# EasyEDA Pro project 2024-4T-MNT-2.eprj

# Schematic 15B_SCH
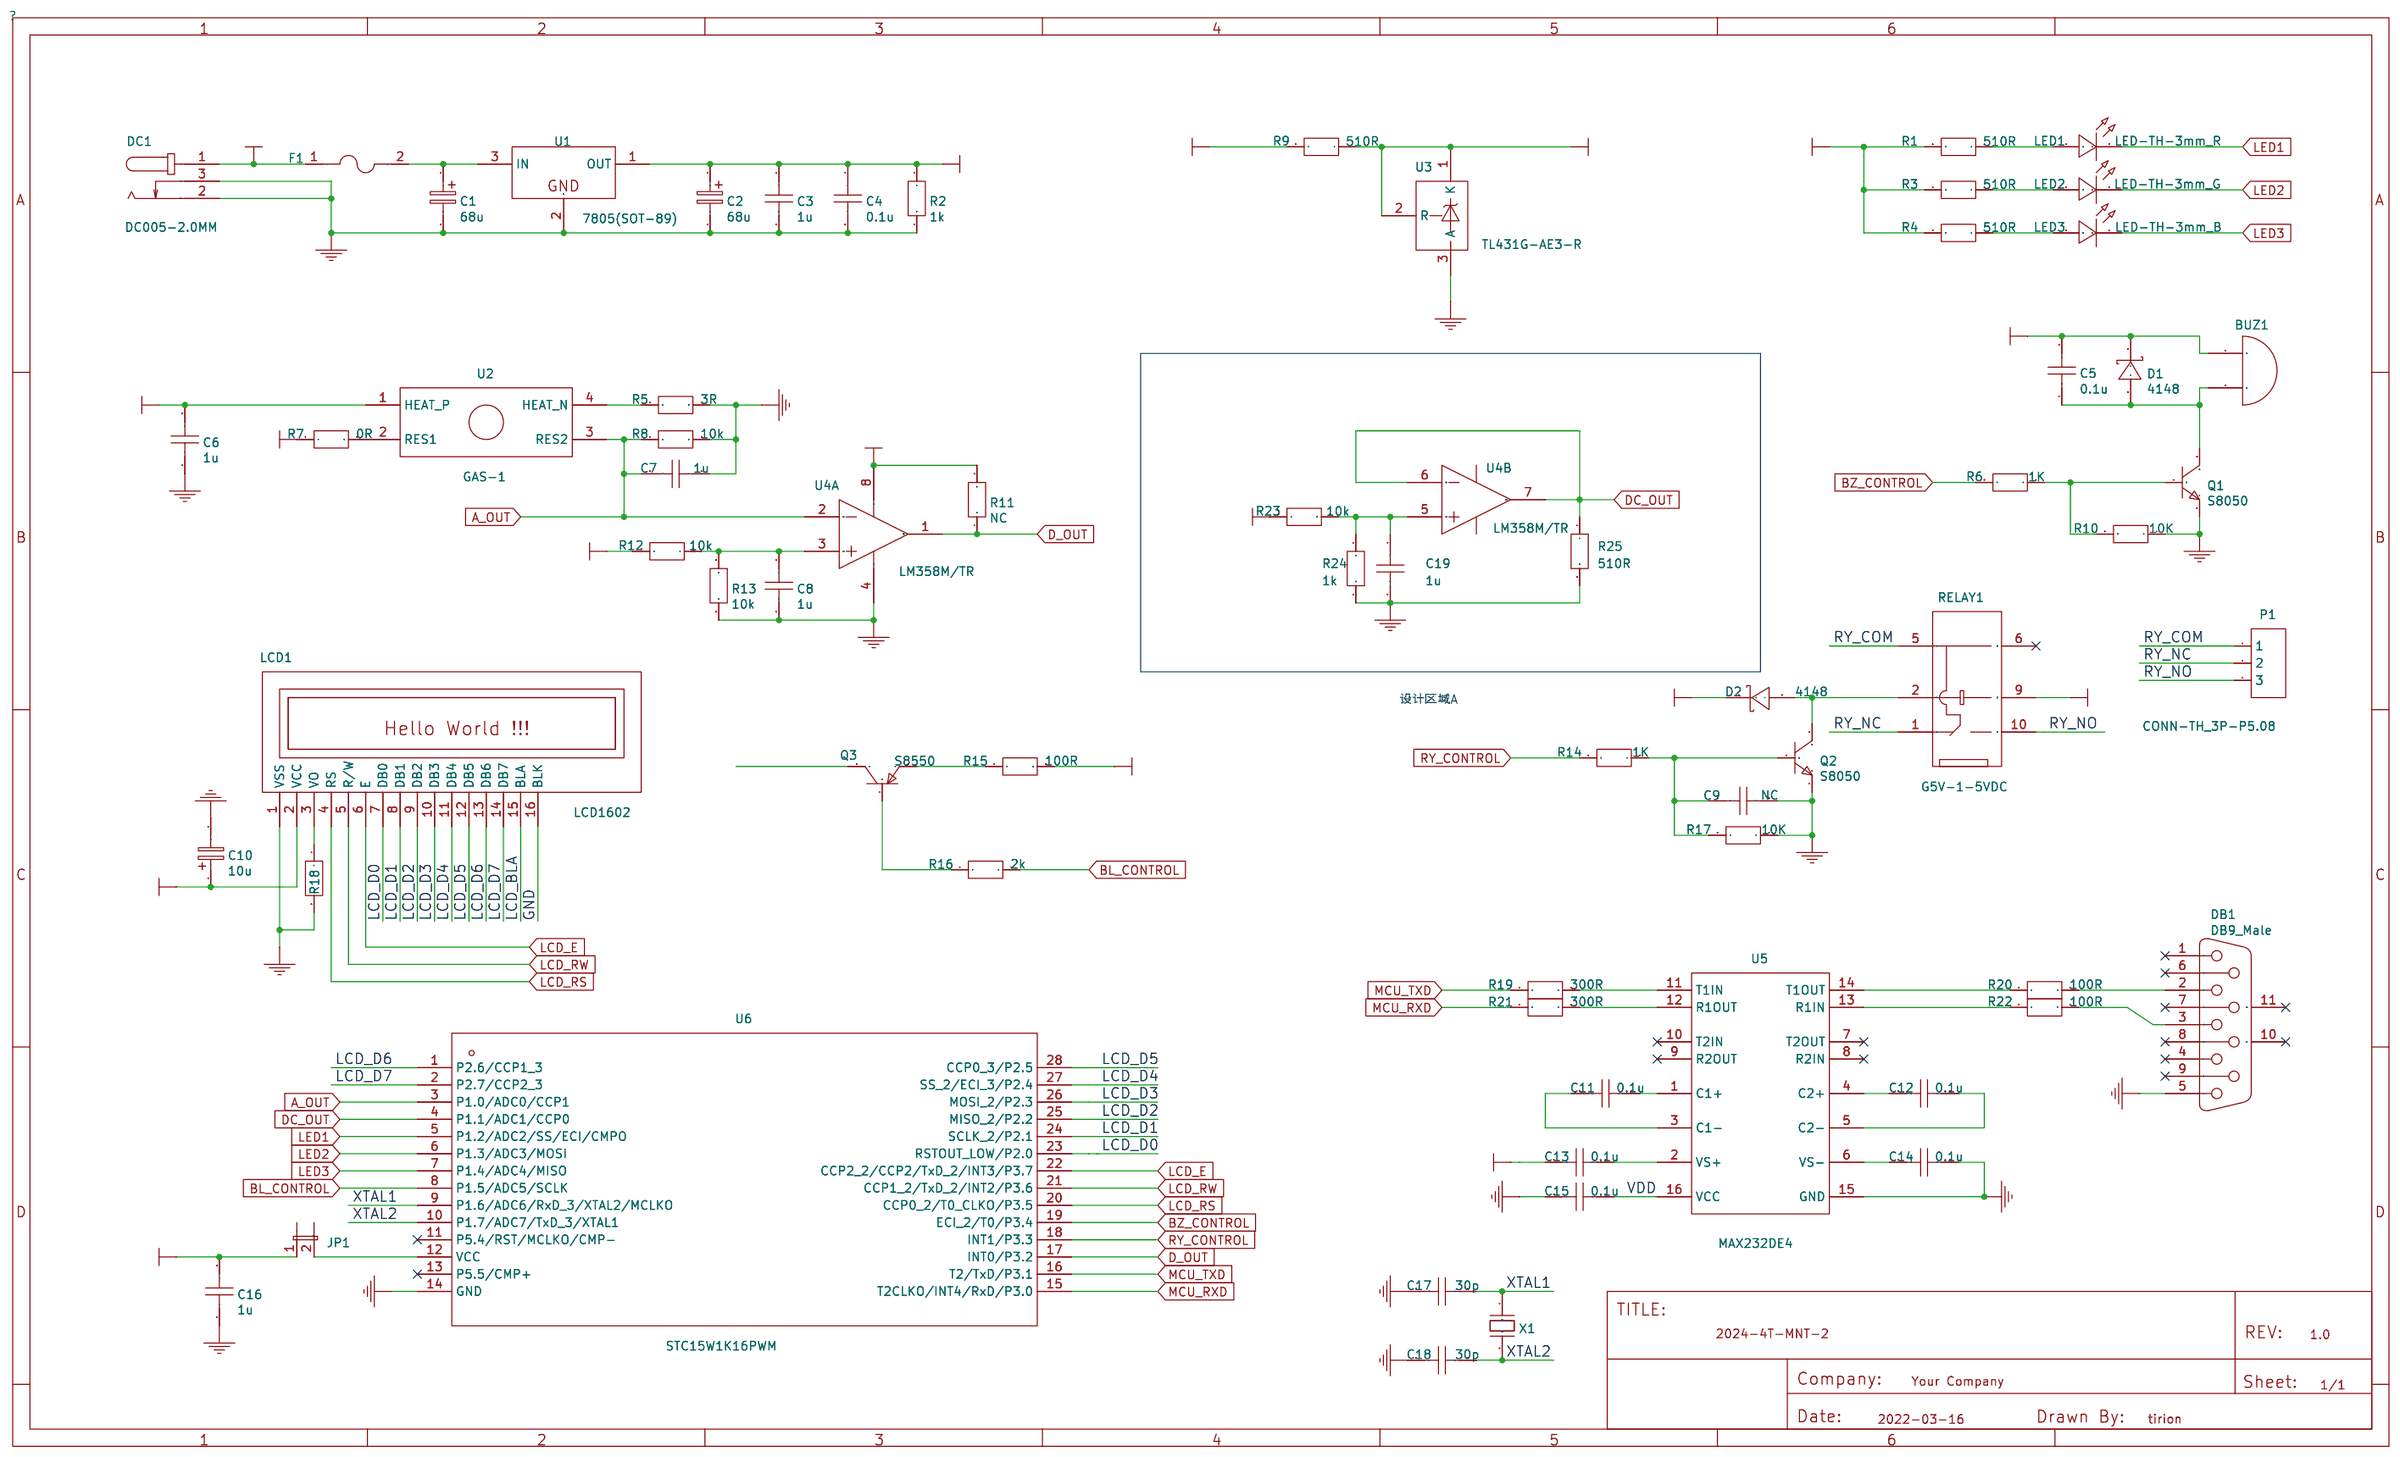
[diagram p0: schematic sheet]

## Parts
BUZ1  BUZ1  [BUZZ]
C1  68u  [CAP-D6.3×H5.5]
C2  68u  [CAP-D6.3×H5.5]
C3  1u  [C0805]
C4  0.1u  [C0805]
C5  0.1u  [C0805]
C6  1u  [C0805]
C7  1u  [C0805]
C8  1u  [C0805]
C9  NC  [C0805]
C10  10u  [CAP-D5.0×H5.5]
C11  0.1u  [C0805]
C12  0.1u  [C0805]
C13  0.1u  [C0805]
C14  0.1u  [C0805]
C15  0.1u  [C0805]
C16  1u  [C0805]
C17  30p  [C0805]
C18  30p  [C0805]
C19  1u  [C0805]
D1  4148  [SMA_L4.4-W2.8-LS5.4-RD]
D2  4148  [SMA_L4.4-W2.8-LS5.4-RD]
DB1  DB9_Male  [DSUB-TH_DMR-9P]
DC1  DC005-2.0MM  [DC-IN-TH_DC005]
F1  FUSE_F1812_FUSE  [F1812]
JP1  JUMPER2  [JUMPER2]
LCD1  LCD1602  [LCD1602]
LED1  LED-TH-3mm_R  [LED-TH_BD3.0_RED]
LED2  LED-TH-3mm_G  [LED-TH_BD3.0_GREEN]
LED3  LED-TH-3mm_B  [LED-TH_BD3.0_BLUE]
P1  CONN-TH_3P-P5.08  [CONN-TH_3P-P5.08]
Q1  S8050  [SOT-23-3_L2.9-W1.3-P1.90-LS2.4-BR]
Q2  S8050  [SOT-23-3_L2.9-W1.3-P1.90-LS2.4-BR]
Q3  S8550  [SOT-23-3_L2.9-W1.3-P1.90-LS2.4-BR]
R1  510R  [R0805]
R2  1k  [R0805]
R3  510R  [R0805]
R4  510R  [R0805]
R5  3R  [R0805]
R6  1K  [R0805]
R7  0R  [R0805]
R8  10k  [R0805]
R9  510R  [R0805]
R10  10K  [R0805]
R11  NC  [R0805]
R12  10k  [R0805]
R13  10k  [R0805]
R14  1K  [R0805]
R15  100R  [R0805]
R16  2k  [R0805]
R17  10K  [R0805]
R18  10k  [R0805]
R19  300R  [R0805]
R20  100R  [R0805]
R21  300R  [R0805]
R22  100R  [R0805]
R23  10k  [R0805]
R24  1k  [R0805]
R25  510R  [R0805]
RELAY1  G5V-1-5VDC  [RELAY-TH_G5V-1]
U1  7805(SOT-89)  [SOT-89-3_L4.5-W2.5-P1.50-LS4.2-BR]
U2  GAS-1  [GAS-1]
U3  TL431G-AE3-R  [SOT-23-3_L2.9-W1.3-P1.90-LS2.4-TR]
U4  LM358M/TR  [SOP-8_L4.9-W3.9-P1.27-LS6.0-BL]  (sections 1,2)
U5  MAX232DE4  [SOIC16N]
U6  STC15W1K16PWM  [SOP-28_L17.9-W7.5-P1.27-LS10.3-BL]
X1  12MHZ  [OSC-49U-1]

## Library data of the parts
BUZ1 = BUZ1
C1 C2 = 68u
C3 C6-C8 C16 C19 = 1u
C4 C5 C11-C15 = 0.1u
C9 R11 = NC
C10 = 10u
C17 C18 = 30p
D1 D2 = SS14: Supplier: LCSC; Manufacturer: MDD; Supplier Part: C2480; JLCPCB Part Class: Basic Part
DB1 = DB9_Male: Supplier Part: C185657; Supplier: LCSC; Manufacturer: Amphenol
DC1 = DC005-2.0MM: Supplier: LCSC; Manufacturer: SOFNG; Supplier Part: C111567
F1 = FUSE_F1812_FUSE: Supplier: LCSC; Supplier Part: C9900007509; JLCPCB Part Class: Extended Part
JP1 = JUMPER2: Jumper 2 Pin
LCD1 = LCM1602K-NSW-BBW: Manufacturer: LONTECH(厦门龙特); Supplier Part: C83275; Supplier: LCSC
LED1 = 204-10SDRD/S530-A3-L: Manufacturer: EVERLIGHT(台湾亿光); Supplier Part: C84774; Supplier: LCSC
LED2 = 204-10SYGD/S530-E3: Manufacturer: EVERLIGHT(台湾亿光); Supplier Part: C85161
LED3 = 204-10SUBC/S400-A4: Manufacturer: EVERLIGHT(台湾亿光); Supplier Part: C86881; Supplier: LCSC
P1 = CONN-TH_3P-P5.08: Supplier: LCSC
Q1 Q2 = S8050: Supplier: LCSC; Supplier Part: C916390; Manufacturer: JSMSEMI; JLCPCB Part Class: Extended Part
Q3 = S8550-H: Supplier: LCSC; Supplier Part: C699225; Manufacturer: Yangzhou Yangjie Elec Tech; JLCPCB Part Class: Extended Part
R1 R3 R4 R9 R25 = 510R
R2 R24 = 1k
R5 = 3R
R6 R14 = 1K
R7 = 0R
R8 R12 R13 R18 R23 = 10k
R10 R17 = 10K
R15 R20 R22 = 100R
R16 = 2k
R19 R21 = 300R
RELAY1 = G5V-1-5VDC: Supplier: LCSC; Manufacturer: OMRON; Supplier Part: C28695; JLCPCB Part Class: Extended Part
U1 = CJ78L05: Supplier: LCSC; Manufacturer: CJ; image: //image.lceda.cn/szlcsc/C2079.jpg; Supplier Part: C2079; Paste Type: expand
U2 = GAS-1
U3 = TL431G-AE3-R: Supplier: LCSC; Manufacturer: UTC; Supplier Part: C71130; JLCPCB Part Class: Extended Part
U4 = LM358M/TR: Supplier: LCSC; Supplier Part: C398078; Manufacturer: HGSEMI
U5 = MAX232DE4: Dual EIA-232 Driver  Receiver, 0 to 70 degC, 16-Pin SOIC (D), Green (RoHS  no SbBr)
U6 = STC15W1K16PWM: Supplier: LCSC; Manufacturer: STC; Supplier Part: C65670; JLCPCB Part Class: Extended Part
X1 = X49UD12MSD2SC: Supplier Part: undefined; Supplier: LCSC; Manufacturer: LCSC

## Nets
GND: C1.2 C2.2 C3.2 C4.2 C6.1 C7.1 C8.2 C9.2 C10.2 C14.2 C15.1 C16.1 C17.2 C18.2 C19.2 DB1.5 DC1.2 DC1.3 LCD1.1(VSS) LCD1.16(BLK) Q1.2(E) Q2.2(E) R2.2 R5.2 R8.2 R10.1 R13.2 R17.1 R18.2 R24.2 R25.2 U1.2(GND) U3.3(A) U4.4(GND) U5.15(GND) U6.14(GND)
VDD: BUZ1.1(A) C2.1 C3.1 C4.1 C5.2 C6.2 C10.1 C13.1 C15.2 C16.2 D1.1(K) D2.1(K) JP1.1 LCD1.2(VCC) R1.2 R2.1 R3.2 R4.2 R9.2 R11.2 R15.2 RELAY1.9 U1.1(OUT) U2.1(HEAT_P) U4.8(VCC) U5.16(VCC)
A_OUT: C7.2 R8.1 U2.3(RES2) U4.2(1IN-) U6.3(P1.0/ADC0/CCP1)
BL_CONTROL: R16.2 U6.8(P1.5/ADC5/SCLK)
BZ_CONTROL: R6.2 U6.19(ECI_2/T0/P3.4)
D_OUT: R11.1 U4.1(1OUT) U6.17(INT0/P3.2)
DC_IN: DC1.1 F1.1 R23.2
DC_OUT: R25.1 U4.6(2IN-) U4.7(2OUT) U6.4(P1.1/ADC1/CCP0)
LCD_BLA: LCD1.15(BLA)
LCD_D0: LCD1.7(DB0) U6.23(RSTOUT_LOW/P2.0)
LCD_D1: LCD1.8(DB1) U6.24(SCLK_2/P2.1)
LCD_D2: LCD1.9(DB2) U6.25(MISO_2/P2.2)
LCD_D3: LCD1.10(DB3) U6.26(MOSI_2/P2.3)
LCD_D4: LCD1.11(DB4) U6.27(SS_2/ECI_3/P2.4)
LCD_D5: LCD1.12(DB5) U6.28(CCP0_3/P2.5)
LCD_D6: LCD1.13(DB6) U6.1(P2.6/CCP1_3)
LCD_D7: LCD1.14(DB7) U6.2(P2.7/CCP2_3)
LCD_E: LCD1.6(E) U6.22(CCP2_2/CCP2/TxD_2/INT3/P3.7)
LCD_RS: LCD1.4(RS) U6.20(CCP0_2/T0_CLKO/P3.5)
LCD_RW: LCD1.5(R/W) U6.21(CCP1_2/TxD_2/INT2/P3.6)
LED1: LED1.2 U6.5(P1.2/ADC2/SS/ECI/CMPO)
LED2: LED2.2 U6.6(P1.3/ADC3/MOSI)
LED3: LED3.2 U6.7(P1.4/ADC4/MISO)
MCU_RXD: R21.1 U6.15(T2CLKO/INT4/RxD/P3.0)
MCU_TXD: R19.1 U6.16(T2/TxD/P3.1)
RY_COM: P1.1 RELAY1.5
RY_CONTROL: R14.2 U6.18(INT1/P3.3)
RY_NC: P1.2 RELAY1.1
RY_NO: P1.3 RELAY1.10
VREF: R7.1 R9.1 R12.2 U3.1(K) U3.2(R)
XTAL1: C17.1 U6.9(P1.6/ADC6/RxD_3/XTAL2/MCLKO) X1.1(OSC1)
XTAL2: C18.1 U6.10(P1.7/ADC7/TxD_3/XTAL1) X1.2(OSC2)
$1N38: R5.1 U2.4(HEAT_N)
$1N129: C8.1 R12.1 R13.1 U4.3(1IN+)
$1N261: C11.2 U5.1(C1+)
$1N262: C11.1 U5.3(C1-)
$1N307: C13.2 U5.2(VS+)
$1N323: C12.1 U5.4(C2+)
$1N324: C12.2 U5.5(C2-)
$1N325: C14.1 U5.6(VS-)
$1N349: R19.2 U5.11(T1IN)
$1N361: R21.2 U5.12(R1OUT)
$1N384: R20.1 U5.14(T1OUT)
$1N385: DB1.2 R20.2
$1N395: R22.1 U5.13(R1IN)
$1N396: DB1.3 R22.2
$1N410: JP1.2 U6.12(VCC)
$1N453: D2.2(A) Q2.3(C) RELAY1.2
$1N454: C9.1 Q2.1(B) R14.1 R17.2
$1N534: Q1.1(B) R6.1 R10.2
$1N571: BUZ1.2(B) C5.1 D1.2(A) Q1.3(C)
$1N627: LCD1.3(VO) R18.1
$1N796: LED1.1 R1.1
$1N816: LED3.1 R4.1
$1N817: LED2.1 R3.1
$1N913: C1.1 F1.2 U1.3(IN)
$1N1047: R7.2 U2.2(RES1)
$1N2159: Q3.2(E) R15.1
$1N2169: Q3.1(B) R16.1
$1N3986: C19.1 R23.1 R24.1 U4.5(2IN+)

Not connected (* = marked no-connect by the designer): DB1 1* 4* 6* 7* 8* 9* 10(MH1)* 11(MH2)*; Q3 3(C); RELAY1 6*; U5 7(T2OUT)* 8(R2IN)* 9(R2OUT)* 10(T2IN)*; U6 11(P5.4/RST/MCLKO/CMP-)* 13(P5.5/CMP+)*

## Notes on the sheet
- 设计区域A

# Board PCB
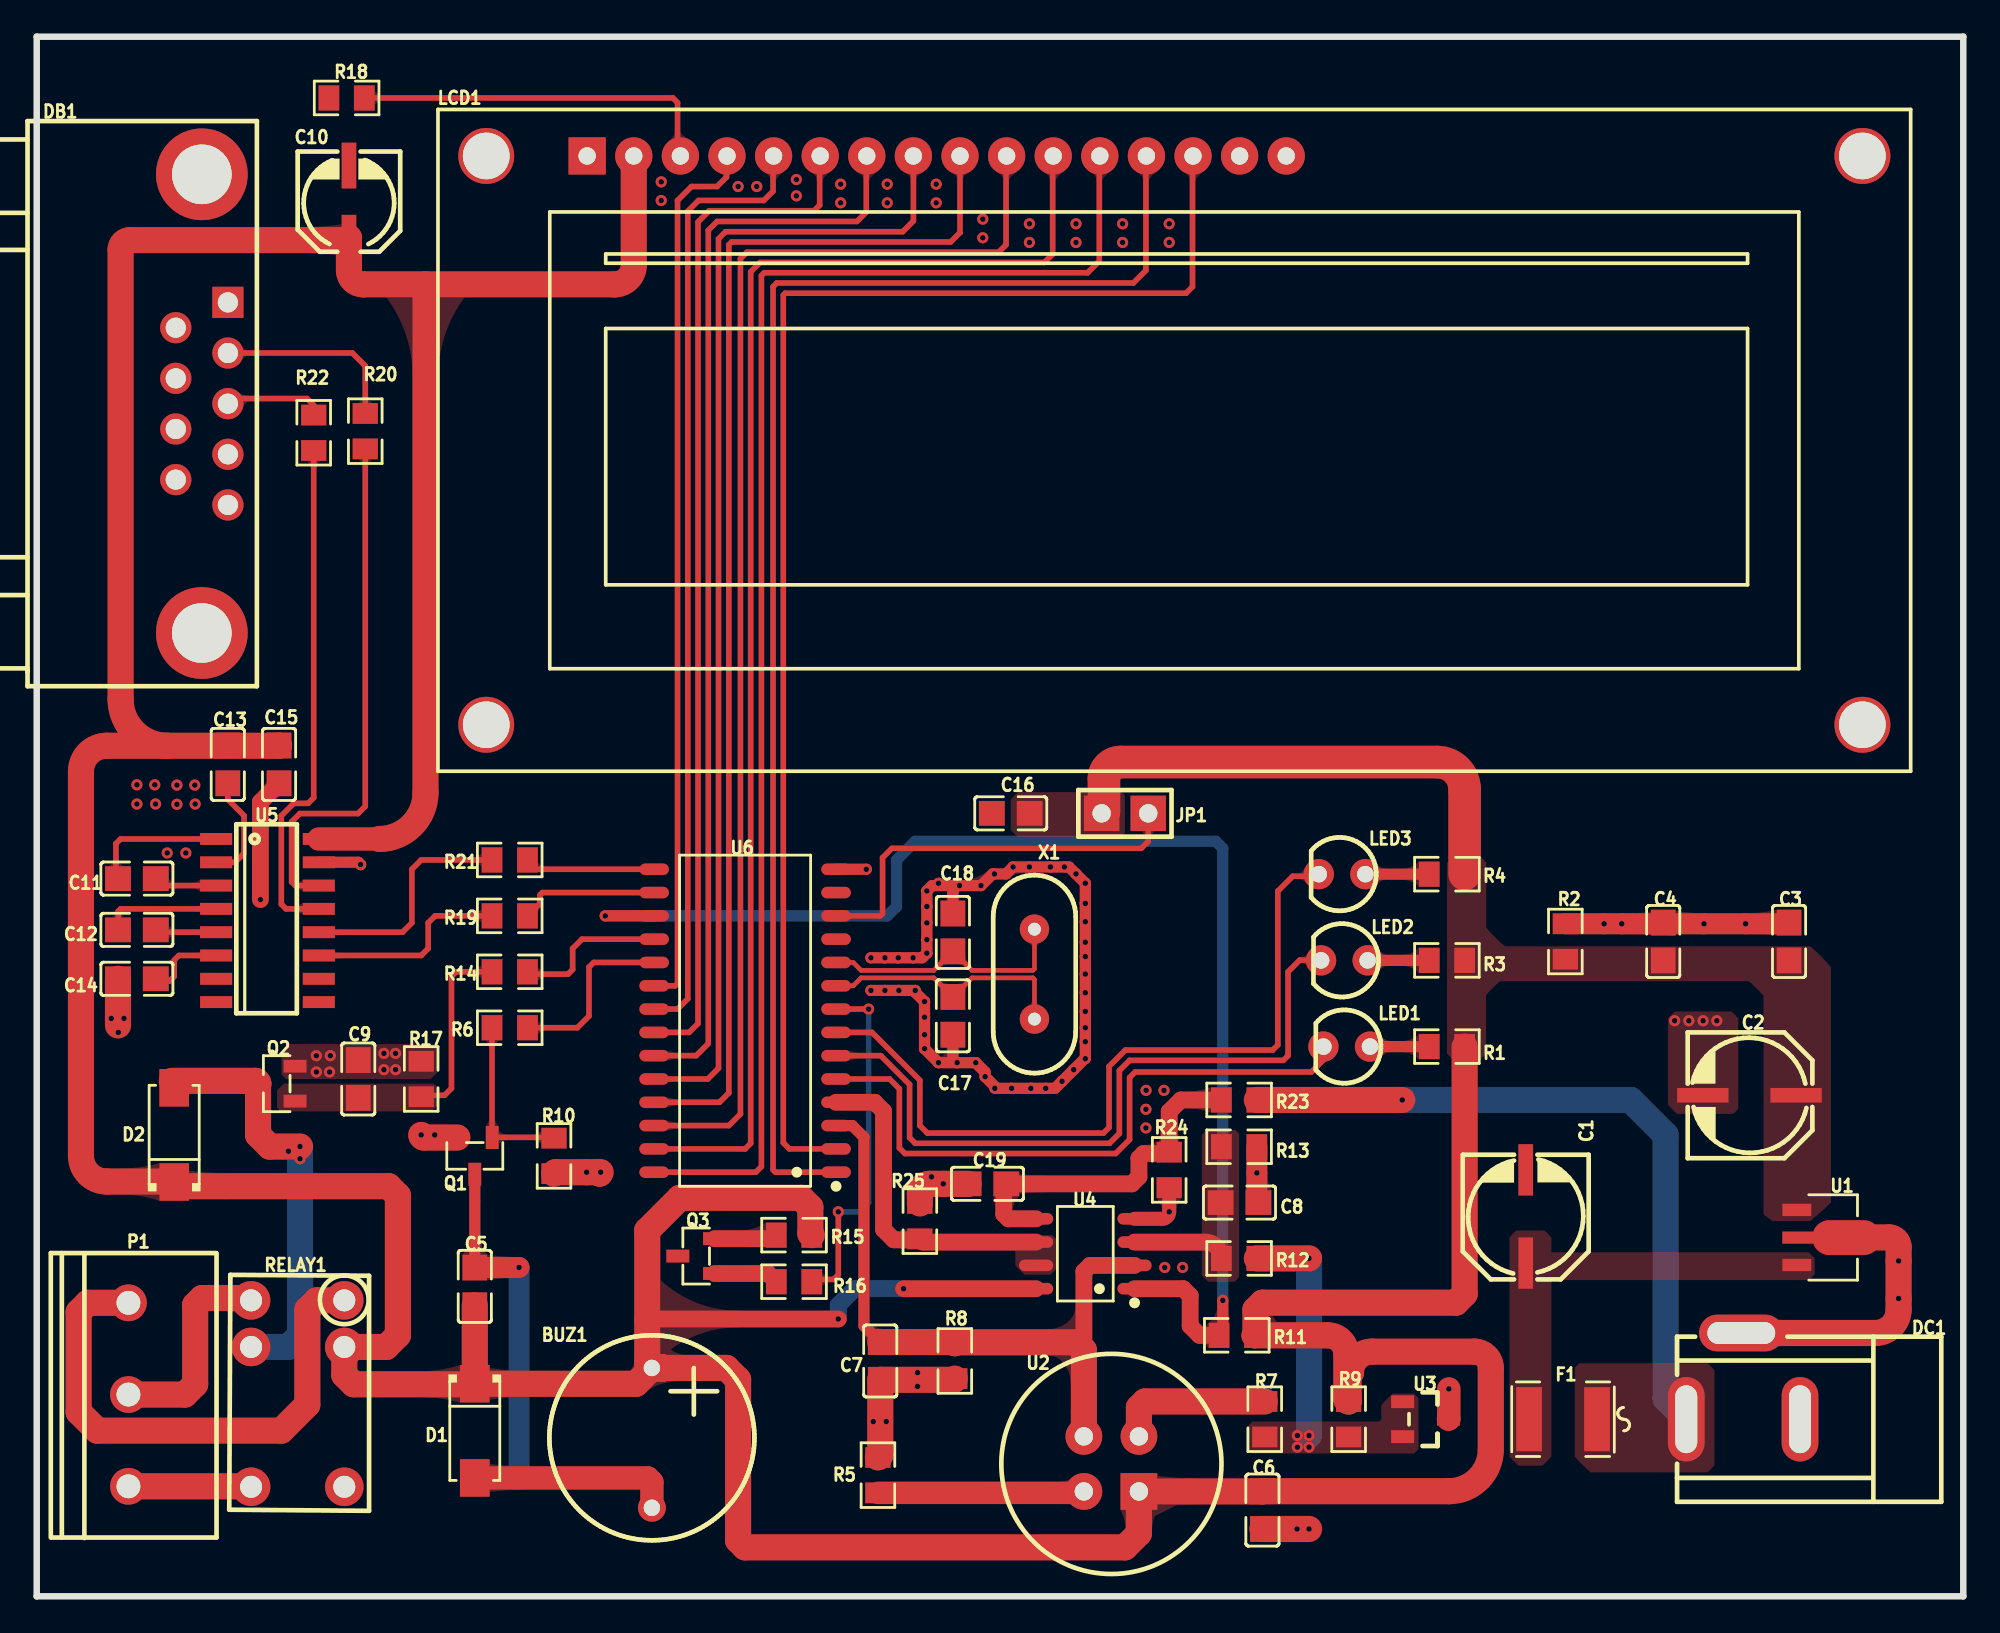
[diagram p1: board, top side]
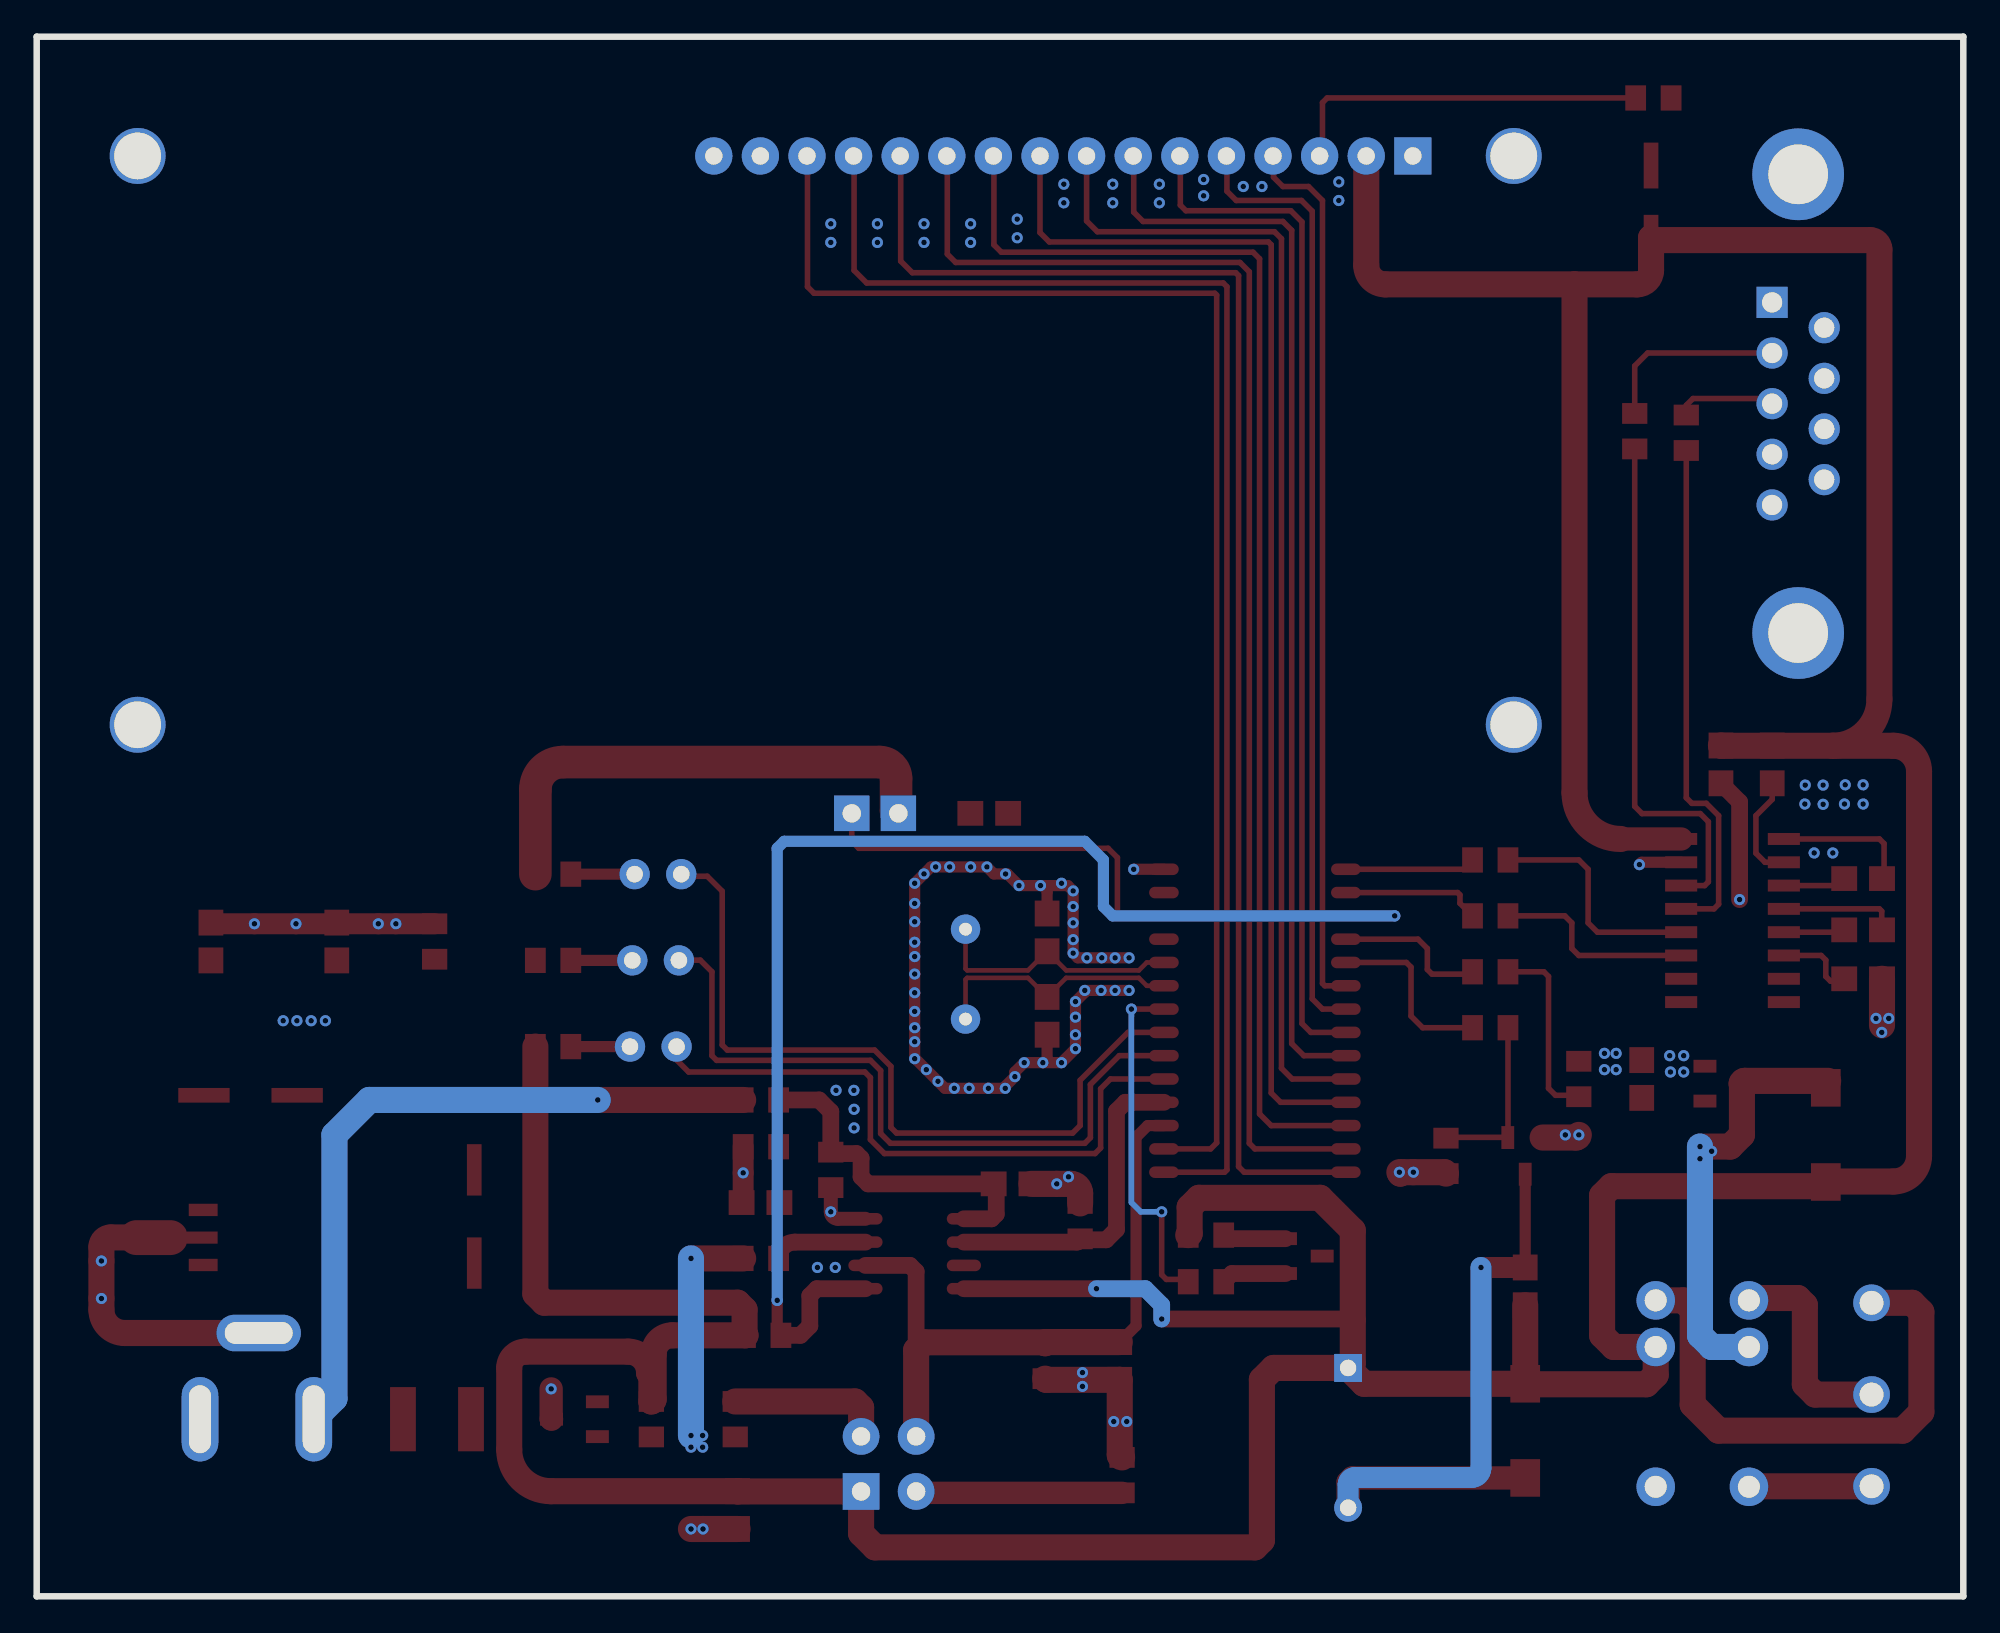
[diagram p2: board, bottom side, seen from below]

Outline 105 x 85 mm; copper layers: Top Layer, Bottom Layer. Coordinates in mm from the lower left corner of the outline.
Outline path: 0,85 105,85 105,0 0,0 0,85
Stack: Top Layer 0.035mm / Dielectric1 1.51mm FR4 er 4.5 / Bottom Layer 0.035mm

## Design rules (mm)
net XTAL1: DP1
net XTAL2: DP1
template: 用户自定义配置
spacing Default (default): track to track 0.254, other pairs 0 to 0.254
track width Default (default): min 0.254, default 0.305, max 25.4
track width PWR: min 0.254, default 0.61, max 2.54
differential pair differentialPair (default): width min 0.127, default 0.254, max 2.54; gap min 0.152, default 0.152
via Default (default): diameter min 0.61, default 0.61, max 100.025; hole min 0.305, default 0.305, max 59.995
net VDD uses PWR
net A_OUT uses PWR
net GND uses PWR
net VREF uses PWR
net D_OUT uses PWR
net DC_OUT uses PWR
net DC_IN uses PWR

## Placement (name value [footprint] x y rotation side)
BUZ1  BUZ1  [BUZZ]  33.53 12.45 270 top
C1  68u  [CAP-D6.3×H5.5]  81.15 23.24 270 top
C2  68u  [CAP-D6.3×H5.5]  90.81 27.31 0 top
C3  1u  [C0805]  95.5 35.69 90 top
C4  0.1u  [C0805]  88.65 35.69 90 top
C5  0.1u  [C0805]  23.88 16.89 270 top
C6  1u  [C0805]  66.8 4.7 90 top
C7  1u  [C0805]  45.97 12.83 90 top
C8  1u  [C0805]  65.55 21.46 0 top
C9  NC  [C0805]  17.53 28.19 90 top
C10  10u  [CAP-D5.0×H5.5]  17.02 77.98 270 top
C11  0.1u  [C0805]  5.46 39.12 180 top
C12  0.1u  [C0805]  5.46 36.32 0 top
C13  0.1u  [C0805]  10.41 45.34 270 top
C14  0.1u  [C0805]  5.46 33.66 180 top
C15  0.1u  [C0805]  13.21 45.34 90 top
C16  1u  [C0805]  53.09 42.67 0 top
C17  30p  [C0805]  49.93 31.64 270 top
C18  30p  [C0805]  49.93 36.18 90 top
C19  1u  [C0805]  51.82 22.48 180 top
D1  4148  [SMA_L4.4-W2.8-LS5.4-RD]  23.88 9.02 270 top
D2  4148  [SMA_L4.4-W2.8-LS5.4-RD]  7.49 25.15 90 top
DB1  DB9_Male  [DSUB-TH_DMR-9P]  9 65 180 top
DC1  DC005-2.0MM  [DC-IN-TH_DC005]  93 12 180 top
F1  FUSE_F1812_FUSE  [F1812]  83.19 9.65 180 top
JP1  -  [JUMPER2]  59.31 42.67 180 top
LCD1  -  [LCD1602]  62 63 0 top
LED1  LED-TH-3mm_R  [LED-TH_BD3.0_RED]  71.4 29.96 270 top
LED2  LED-TH-3mm_G  [LED-TH_BD3.0_GREEN]  71.27 34.66 270 top
LED3  LED-TH-3mm_B  [LED-TH_BD3.0_BLUE]  71.14 39.36 270 top
P1  -  [CONN-TH_3P-P5.08]  5 11 90 top
Q1  S8050  [SOT-23-3_L2.9-W1.3-P1.90-LS2.4-BR]  23.88 24 90 top
Q2  S8050  [SOT-23-3_L2.9-W1.3-P1.90-LS2.4-BR]  13.08 27.94 0 top
Q3  S8550  [SOT-23-3_L2.9-W1.3-P1.90-LS2.4-BR]  35.94 18.54 0 top
R1  510R  [R0805]  76.86 29.96 0 top
R2  1k  [R0805]  83.31 35.69 90 top
R3  510R  [R0805]  76.86 34.66 0 top
R4  510R  [R0805]  76.86 39.36 0 top
R5  3R  [R0805]  45.85 6.6 90 top
R6  1K  [R0805]  25.78 30.99 0 top
R7  0R  [R0805]  66.93 9.65 90 top
R8  10k  [R0805]  50.04 12.83 270 top
R9  510R  [R0805]  71.5 9.65 90 top
R10  10K  [R0805]  28.19 24 90 top
R11  NC  [R0805]  65.41 14.22 0 top
R12  10k  [R0805]  65.53 18.41 0 top
R13  10k  [R0805]  65.53 24.5 0 top
R14  1K  [R0805]  25.78 34.04 0 top
R15  100R  [R0805]  41.28 19.69 0 top
R16  2k  [R0805]  41.28 17.15 0 top
R17  10K  [R0805]  20.95 28.19 270 top
R18  10k  [R0805]  16.89 81.66 180 top
R19  300R  [R0805]  25.78 37.08 180 top
R20  100R  [R0805]  17.91 63.5 90 top
R21  300R  [R0805]  25.78 40.13 180 top
R22  100R  [R0805]  15.1 63.41 90 top
R23  10k  [R0805]  65.53 27.05 0 top
R24  1k  [R0805]  61.72 23.24 270 top
R25  510R  [R0805]  48.13 20.45 90 top
RELAY1  G5V-1-5VDC  [RELAY-TH_G5V-1]  14.22 11.05 270 top
U1  7805(SOT-89)  [SOT-89-3_L4.5-W2.5-P1.50-LS4.2-BR]  97.28 19.56 180 top
U2  -  [GAS-1]  60.07 5.72 180 top
U3  TL431G-AE3-R  [SOT-23-3_L2.9-W1.3-P1.90-LS2.4-TR]  75.69 9.65 180 top
U4  LM358M/TR  [SOP-8_L4.9-W3.9-P1.27-LS6.0-BL]  57.15 18.67 90 top
U5  MAX232DE4  [SOIC16N]  9.78 41.28 270 top
U6  STC15W1K16PWM  [SOP-28_L17.9-W7.5-P1.27-LS10.3-BL]  38.61 31.37 90 top
X1  12MHZ  [OSC-49U-1]  54.38 33.91 180 top

## Footprints (pads in the part's own frame, mm; a bottom-side part is the same pattern mirrored in y, then rotated)
BUZZ
  rect 1.524x1.524 hole 0.894x0.889: 1(0,0)
  round 1.524 hole 0.894x0.889: 2(7.62,0)
C0805
  rect 1.41x1.35 smd: 1(-1.03,0) 2(1.03,0)
CAP-D5.0×H5.5
  rect 2.5x0.8 smd: 1(3.937,0) 2(0,0)
CAP-D6.3×H5.5
  rect 2.8x0.8 smd: 1(5.08,0) 2(0,0)
CONN-TH_3P-P5.08
  round 2 hole 1.3: 1(-5.005,0) 2(-0.005,0) 3(4.995,0)
DC-IN-TH_DC005
  oval 2x4.6 hole 1.2x3.7: 1(3.1,2.35) 2(-3.1,2.35)
  oval 4.6x2 hole 3.7x1.2: 3(0.1,-2.35)
DSUB-TH_DMR-9P
  rect 1.7x1.7 hole 1.1: 1(-1.42,-5.52)
  round 1.7 hole 1.1: 2(-1.42,-2.76) 3(-1.42,0) 4(-1.42,2.76) 5(-1.42,5.52) 6(1.42,-4.14) 7(1.42,-1.38) 8(1.42,1.38) 9(1.42,4.14)
  round 5 hole 3.25: 10(0,12.5) 11(0,-12.5)
F1812
  rect 1.407x3.499 smd: 1(-1.853,0) 2(1.853,0)
GAS-1
  rect 2x2 hole 1: 1(0,0)
  round 2 hole 1: 2(0,-3) 3(3,-3) 4(3,0)
JUMPER2
  rect 1.931x1.931 hole 1.001: 1(1.27,0) 2(-1.27,0)
LCD1602
  round 3.048 hole 2.545x2.54: 0(-37.5,15.5) 17(-37.5,-15.5) 18(37.5,15.5) 19(37.5,-15.5)
  rect 2.032x2.032 hole 0.945: 1(-32,15.5)
  round 2.032 hole 0.945: 2(-29.46,15.5) 3(-26.92,15.5) 4(-24.38,15.5) 5(-21.84,15.5) 6(-19.3,15.5) 7(-16.76,15.5) 8(-14.22,15.5) 9(-11.68,15.5) 10(-9.14,15.5) 11(-6.6,15.5) 12(-4.06,15.5) 13(-1.52,15.5) 14(1.02,15.5) 15(3.56,15.5) 16(6.1,15.5)
LED-TH_BD3.0_BLUE
  round 1.651 hole 0.9: 1(0,1.27) 2(0,-1.27)
LED-TH_BD3.0_GREEN
  round 1.651 hole 0.9: 1(0,1.27) 2(0,-1.27)
LED-TH_BD3.0_RED
  round 1.651 hole 0.9: 1(0,1.27) 2(0,-1.27)
OSC-49U-1
  round 1.6 hole 0.7: 1(0,2.45) 2(0,-2.45)
R0805
  rect 1.133x1.377 smd: 1(-0.966,0) 2(0.966,0)
RELAY-TH_G5V-1
  round 2.1 hole 1.2: 1(-5.08,-2.54) 2(-2.54,-2.54) 5(5.08,-2.54) 6(5.08,2.54) 9(-2.54,2.54) 10(-5.08,2.54)
SMA_L4.4-W2.8-LS5.4-RD
  rect 2.046x1.62 smd: 1(-2.566,0) 2(2.566,0)
SOIC16N
  rect 0.65x1.75 smd: 1(0,0) 2(1.27,0) 3(2.54,0) 4(3.81,0) 5(5.08,0) 6(6.35,0) 7(7.62,0) 8(8.89,0) 9(8.89,5.598) 10(7.62,5.598) 11(6.35,5.598) 12(5.08,5.598) 13(3.81,5.598) 14(2.54,5.598) 15(1.27,5.598) 16(0,5.598)
SOP-8_L4.9-W3.9-P1.27-LS6.0-BL
  oval 0.63x1.865 smd: 1(-1.905,-2.683) 2(-0.635,-2.683) 3(0.635,-2.683) 4(1.905,-2.683) 5(1.905,2.683) 6(0.635,2.683) 7(-0.635,2.683) 8(-1.905,2.683)
SOP-28_L17.9-W7.5-P1.27-LS10.3-BL
  oval 0.63x1.615 smd: 1(-8.255,-4.957) 2(-6.985,-4.957) 3(-5.715,-4.957) 4(-4.445,-4.957) 5(-3.175,-4.957) 6(-1.905,-4.957) 7(-0.635,-4.957) 8(0.635,-4.957) 9(1.905,-4.957) 10(3.175,-4.957) 11(4.445,-4.957) 12(5.715,-4.957) 13(6.985,-4.957) 14(8.255,-4.957) 15(8.255,4.957) 16(6.985,4.957) 17(5.715,4.957) 18(4.445,4.957) 19(3.175,4.957) 20(1.905,4.957) 21(0.635,4.957) 22(-0.635,4.957) 23(-1.905,4.957) 24(-3.175,4.957) 25(-4.445,4.957) 26(-5.715,4.957) 27(-6.985,4.957) 28(-8.255,4.957)
SOT-23-3_L2.9-W1.3-P1.90-LS2.4-BR
  rect 1.25x0.7 smd: 1(1,-0.95) 2(1,0.95) 3(-1,0)
SOT-23-3_L2.9-W1.3-P1.90-LS2.4-TR
  rect 1.25x0.7 smd: 1(1.25,0.95) 2(1.25,-0.95) 3(-1.25,0)
SOT-89-3_L4.5-W2.5-P1.50-LS4.2-BR
  rect 1.575x0.672 smd: 1(1.356,-1.5) 3(1.356,1.5)
  custom 5.377x1.9 smd: 2(-1.356,0.009)

## Nets
As in the schematic.

Pads without a net: DB1 1 4 6 7 8 9 10 11; LCD1 0 17 18 19; RELAY1 6; U5 7 8 9 10; U6 11 13

## Via types
v1: diameter 0.61, hole 0.305, Top Layer to Bottom Layer, 140 vias

## Routing (per net, layer and track width the routed paths; a pad name or vN(x,y) marks a point on that pad's centre or on a via; arc(x,y) is an arc through that point)
GND: length 114
  Top Layer w0.61: v1(50.16,29.08) v1(49.15,29.08) v1(48.39,29.84) v1(48.39,30.61) v1(48.39,31.56) v1(48.39,32.41) 47.88,32.92 v1(47.88,33.02) v1(46.99,33.02) v1(46.23,33.02) v1(45.47,33.02) ; v1(50.16,29.08) v1(51.18,29.08) 51.69,28.58 v1(51.69,28.32) 52.32,27.69 v1(53.13,27.69) v1(54.18,27.69) v1(54.99,27.69) 55.5,27.69 v1(55.88,28.07) v1(56.51,28.7) 57.15,29.34 v1(57.15,30.23) v1(57.15,30.99) v1(57.15,31.88) v1(57.15,32.89) v1(57.15,33.92) v1(57.15,34.87) v1(57.15,35.65) v1(57.15,36.76) v1(57.15,37.76) v1(57.15,38.86) v1(56.64,39.37) 56.26,39.75 v1(55.25,39.75) v1(54.1,39.75) v1(53.21,39.75) 52.83,39.37 v1(52.2,39.37) 52.1,39.37 v1(51.46,38.73) v1(50.29,38.73) ; v1(50.16,29.08) arc(50,29.15) 49.93,29.31 C17.2 ; C18.2 49.93,38.38 arc(50.04,38.63) v1(50.29,38.73) ; v1(17.65,39.88) 17.53,40 15.38,40 ; v1(45.47,34.8) v1(46.23,34.8) v1(46.95,34.8) v1(47.76,34.8) 48.26,34.8 v1(48.51,35.05) v1(48.51,35.79) v1(48.51,36.7) v1(48.51,37.59) v1(48.51,38.44) 48.81,38.73 v1(50.29,38.73) ; U6.14 v1(45.21,39.62)
  Top Layer w0.762: R24.2 v1(61.72,20.96) arc(61.61,20.69) 61.34,20.57 U4.4
  Top Layer w0.914: C15.1 12.19,43.29 v1(12.19,37.97)
  Top Layer w1.143: R13.2 v1(66.5,23.08) 66.5,21.54 arc(66.52,21.48) C8.2 ; R2.2 v1(85.42,36.65) v1(86.38,36.65) v1(90.87,36.65) v1(93.13,36.65) 95.44,36.65 arc(95.49,36.67) C3.2
  Top Layer w1.27: v1(76.96,11.3) 76.96,9.67 U3.3
  Top Layer w1.423: R10.1 28.27,23.11 v1(29.97,23.11) 30.61,23.11 30.68,23.04 arc(30.68,23.05) 30.68,23.06 arc(30.7,23.1) v1(30.73,23.11) ; Q1.2 21.1,25 arc(21,25.04) v1(20.95,25.15) ; v1(69.34,3.67) v1(68.69,3.67) C6.1 ; C19.2 v1(49.41,22.48) 48.64,22.48 arc(48.28,22.33) 48.13,21.97 R25.2 ; DC1.3 100.2,14.35 arc(101.1,14.72) 101.47,15.62 v1(101.47,16.23) v1(101.47,18.28) 101.47,19.05 arc(101.32,19.41) 100.97,19.56 98.65,19.56 arc(98.64,19.56) U1.2 ; C14.2 4.43,31.11 ; R5.2 arc(45.94,7.61) 45.97,7.7 C7.1 49.97,11.8 arc(50.02,11.82) R8.2
  vias: v1(4.06,31.5) v1(4.44,30.73) v1(4.76,31.5) v1(5.46,44.23) v1(5.46,43.18) v1(6.43,44.23) v1(6.48,43.18) v1(7.11,40.51) v1(7.64,44.21) v1(7.64,43.16) v1(8.13,40.51) v1(8.61,44.21) v1(8.64,43.18) v1(15.24,29.46) v1(15.24,28.58) v1(16,29.46) v1(15.96,28.58) v1(18.92,29.59) v1(18.92,28.7) v1(19.56,29.59) v1(19.56,28.7) v1(21.69,25.15) v1(34.04,77.09) v1(34.04,76.07) v1(38.23,76.83) v1(39.24,76.83) v1(41.4,77.22) v1(41.4,76.33) v1(43.81,76.96) v1(43.81,75.95) v1(45.59,9.53) v1(46.3,9.53) v1(46.35,76.96) v1(46.35,75.95) v1(48.01,12.19) v1(48.01,11.44) v1(48.77,22.86) v1(49.02,76.96) v1(49.02,75.95) v1(49.15,38.86) v1(51.56,75.06) v1(51.56,74.04) v1(52.22,27.69) v1(54.1,74.8) v1(54.1,73.79) v1(56.01,39.75) v1(56.64,74.8) v1(56.64,73.79) v1(57.15,29.3) v1(59.18,74.8) v1(59.18,73.79) v1(60.46,27.57) v1(60.45,26.54) v1(60.45,25.53) v1(61.44,27.57) v1(61.48,17.92) v1(61.72,74.8) v1(61.72,73.79) v1(62.45,17.92) v1(89.27,31.37) v1(90.04,31.37) v1(90.82,31.37) v1(91.57,31.37)
VDD: length 362.9
  Top Layer w0.914: v1(43.69,15.11) 33.33,15.11 33.27,15.05 ; v1(47.24,16.76) U4.8
  Top Layer w1.27: 18.67,41.28 U5.16
  Top Layer w1.423: D1.1 C5.2 ; D1.1 32.66,11.58 BUZ1.1 ; D1.1 23.85,11.56 17.27,11.56 16.76,12.06 RELAY1.9 19.05,13.59 19.69,14.22 19.69,21.84 19.18,22.35 7.49,22.35 ; BUZ1.1 33.27,12.7 33.27,19.94 35.05,21.72 41.66,21.72 42.16,21.21 42.16,19.76 R15.2 ; BUZ1.1 37.59,12.45 38.23,11.81 38.23,3.05 38.61,2.67 59.31,2.67 60.07,3.43 U2.1 66.79,5.72 C6.2 76.98,5.73 arc(78.58,6.39) 79.25,8 79.25,12.45 arc(78.99,13.07) 78.36,13.34 72.77,13.34 arc(71.96,13) 71.63,12.19 arc(71.54,12.15) 71.5,12.06 R9.2 arc(71.41,10.66) 71.37,10.75 71.37,13.21 arc(71.08,13.93) 70.36,14.22 R11.2 66.42,14.27 66.42,15.62 66.8,16 77.34,16 77.82,16.48 R1.2 ; 7.11,46.36 13.19,46.36 arc(13.2,46.36) C15.2 ; 7.11,46.36 3.81,46.36 arc(2.82,45.95) 2.41,44.96 2.41,24 arc(2.82,23.02) 3.81,22.61 7.47,22.61 arc(7.49,22.6) D2.1 ; 7.11,46.36 arc(5.32,47.1) 4.57,48.89 4.57,73.41 arc(4.72,73.77) 5.08,73.91 16.89,73.91 arc(16.98,73.95) C10.1 17.02,72.26 arc(17.24,71.72) 17.78,71.5 21.19,71.5 ; 21.19,71.5 21.19,43.8 arc(20.45,42.01) 18.67,41.28 ; 21.19,71.5 31.5,71.5 arc(32.23,71.81) 32.54,72.55 LCD1.2
  Top Layer w1.778: R4.2 77.82,43.97 arc(77.38,45.03) 76.33,45.47 59.06,45.47 arc(58.43,45.21) 58.17,44.58 58.17,42.8 arc(58.13,42.71) JP1.1
  Bottom Layer w0.914: v1(47.24,16.76) 44.58,16.76 43.69,15.88 v1(43.69,15.11)
A_OUT: length 36.5
  Top Layer w0.61: C7.2 45.09,14.75 45.09,25.02 44.45,25.65 U6.3
  Top Layer w0.914: 57.07,13.41 57.07,17.7 57.4,18.03 U4.2
  Top Layer w1.423: U2.3 57.07,13.41 56.64,13.84 50.09,13.84 R8.1 49.97,13.86 C7.2
BL_CONTROL: length 19.2
  Top Layer w0.305: U6.8 v1(45.34,32) ; R16.2 42.37,17.27 43.43,17.27 43.69,17.53 v1(43.69,20.96)
  Bottom Layer w0.305: v1(45.34,32) 45.34,21.46 44.83,20.96 v1(43.69,20.96)
BZ_CONTROL: length 9.9
  Top Layer w0.305: R6.2 29.46,30.99 30.1,31.62 30.1,34.29 30.35,34.54 U6.19
D_OUT: length 72.9
  Top Layer w0.61: v1(64.64,16.13) 64.64,14.43 R11.1 ; U6.17 v1(30.99,37.08)
  Top Layer w0.914: R11.1 63.37,14.22 62.87,14.73 62.87,16.38 62.48,16.76 U4.1
  Bottom Layer w0.61: v1(64.64,16.13) 64.64,40.77 64.26,41.15 47.88,41.15 46.86,40.13 46.86,37.59 46.35,37.08 v1(30.99,37.08)
DC_IN: length 39
  Top Layer w1.423: v1(74.42,27.05) R23.2
  Bottom Layer w1.423: DC1.1 88.77,10.78 88.77,25.15 86.87,27.05 v1(74.42,27.05)
DC_OUT: length 17.9
  Top Layer w0.914: U4.6 48.31,19.3 arc(48.18,19.36) R25.1 48.08,19.43 46.71,19.43 46.15,19.99 46.15,26.44 45.67,26.92 U6.4
LCD_D0: length 59.6
  Top Layer w0.305: U6.23 35.94,29.46 36.6,30.12 36.6,74.45 37.08,74.93 44.7,74.93 45.21,75.44 45.21,78.47 LCD1.7
LCD_D1: length 63.5
  Top Layer w0.305: U6.24 36.58,28.19 37.16,28.78 37.16,73.99 37.54,74.37 47.19,74.37 47.78,74.96 LCD1.8
LCD_D2: length 67.6
  Top Layer w0.305: U6.25 37.21,26.92 37.72,27.43 37.72,73.66 37.87,73.81 49.81,73.81 50.32,74.32 LCD1.9
LCD_D3: length 71.2
  Top Layer w0.305: LCD1.10 52.83,78.47 52.83,73.66 52.43,73.25 38.71,73.25 38.35,72.9 38.35,26.29 37.72,25.65 U6.26
LCD_D4: length 75.1
  Top Layer w0.305: U6.27 38.61,24.38 38.91,24.69 38.91,72.19 39.42,72.69 54.91,72.69 55.37,73.15 55.37,78.47 LCD1.11
LCD_D5: length 79
  Top Layer w0.305: LCD1.12 57.91,78.47 57.91,72.77 57.28,72.14 39.65,72.14 39.5,71.98 39.5,23.42 39.19,23.11 U6.28
LCD_D6: length 78.6
  Top Layer w0.305: LCD1.13 60.45,78.47 60.45,72.26 59.77,71.58 40.34,71.58 40.13,71.37 40.13,23.24 40.26,23.11 U6.1
LCD_D7: length 78.8
  Top Layer w0.305: LCD1.14 62.99,78.47 62.99,71.37 62.64,71.02 40.79,71.02 40.69,70.92 40.69,24.71 41.02,24.38 U6.2
LCD_E: length 56
  Top Layer w0.305: LCD1.6 42.67,78.47 42.67,75.82 42.37,75.51 36.65,75.51 36.04,74.9 36.04,31.22 35.56,30.73 U6.22
LCD_RS: length 48.4
  Top Layer w0.305: U6.20 34.8,33.27 34.93,33.4 34.93,76.07 35.69,76.83 37.08,76.83 37.59,77.34 37.59,78.47 LCD1.4
LCD_RW: length 52
  Top Layer w0.305: U6.21 34.93,32 35.48,32.56 35.48,75.49 36.07,76.07 39.62,76.07 40.13,76.58 40.13,78.47 LCD1.5
LED1: length 35
  Top Layer w0.305: U6.5 46.48,28.19 47.02,27.66 47.02,24.44 47.32,24.13 58.8,24.13 59.56,24.89 59.56,28.27 59.87,28.58 69.47,28.58 70.13,29.23 LED1.2
LED2: length 38.9
  Top Layer w0.305: U6.6 46,29.46 47.57,27.89 47.57,24.99 47.88,24.69 58.47,24.69 59,25.22 59,28.65 59.56,29.21 67.94,29.21 68.2,29.46 68.2,34.04 68.83,34.67 69.99,34.67 LED2.2
LED3: length 42.7
  Top Layer w0.305: LED3.2 69.76,39.24 68.45,39.24 67.64,38.43 67.64,30.05 67.36,29.77 59.33,29.77 58.45,28.88 58.45,25.55 58.14,25.25 48.54,25.25 48.13,25.65 48.13,28.12 45.52,30.73 U6.7
MCU_RXD: length 7.2
  Top Layer w0.305: U6.15 27.25,39.62 arc(26.9,39.77) R21.1
MCU_TXD: length 7.7
  Top Layer w0.305: U6.16 27.56,38.35 27.43,38.23 27.43,37.77 R19.1
RY_COM: length 6.7
  Top Layer w1.423: RELAY1.5 11.66,6 P1.1
RY_CONTROL: length 8.4
  Top Layer w0.305: R14.2 26.87,33.91 28.96,33.91 29.21,34.16 29.21,35.31 29.72,35.81 U6.18
RY_NC: length 11.4
  Top Layer w1.423: P1.2 8.07,11 8.64,11.56 8.64,15.88 9.02,16.26 11.56,16.26 11.68,16.13
RY_NO: length 29.2
  Top Layer w1.423: 16.76,16.13 15.26,16.13 14.75,15.62 14.75,10.44 13.33,9.03 3.3,9.03 2.29,10.05 2.29,15.49 2.79,16 P1.3
VREF: length 12.5
  Top Layer w1.423: R12.2 v1(69.34,18.41)
  Bottom Layer w1.423: v1(69.34,8.76) v1(69.34,18.41)
  vias: v1(68.71,8.76) v1(68.71,8.13) v1(69.34,8.13)
XTAL1: length 14
  Top Layer w0.254: X1.1 54.38,33.62 54.29,33.71 50.97,33.71 C17.1 48.89,33.71 44.93,33.71 44.5,33.27 U6.9
XTAL2: length 14
  Top Layer w0.254: U6.10 44.5,34.54 44.93,34.11 48.89,34.11 C18.1 50.97,34.11 54.29,34.11 54.38,34.2 X1.2
$1N38: length 11.3
  Top Layer w1.219: U2.4 56.99,5.64 R5.1
$1N129: length 5.2
  Top Layer w0.914: U4.3 63.68,19.3 arc(64.31,19.04) R12.1
$1N261: length 7.5
  Top Layer w0.305: U5.1 4.57,41.28 4.32,41.02 4.32,39.23 C11.2
$1N262: length 3.4
  Top Layer w0.305: C11.1 6.87,38.73 U5.3
$1N307: length 5.9
  Top Layer w0.305: C13.2 10.41,43.43 11.3,42.55 11.3,40.5 10.81,40 9.78,40
$1N323: length 6.4
  Top Layer w0.305: C12.1 4.44,36.34 4.44,37.34 4.57,37.47 U5.4
$1N324: length 3.3
  Top Layer w0.305: C12.2 6.62,36.19 U5.5
$1N325: length 4.4
  Top Layer w0.305: C14.1 6.62,33.53 7.24,33.53 7.49,33.78 7.49,34.67 7.75,34.92 9.78,34.92
$1N349: length 11.2
  Top Layer w0.305: 15.38,34.92 20.95,34.92 21.34,35.31 21.34,36.7 21.72,37.08 R19.2
$1N361: length 12.8
  Top Layer w0.305: U5.12 19.94,36.19 20.45,36.7 20.45,39.62 20.95,40.13 R21.2
$1N384: length 28.7
  Top Layer w0.305: U5.14 14.1,38.73 13.89,38.94 13.89,42.22 14.34,42.66 17.51,42.66 17.91,43.05 R20.1
$1N385: length 10.4
  Top Layer w0.305: R20.2 17.91,67.06 17.2,67.76 DB1.2
$1N395: length 28.1
  Top Layer w0.305: U5.13 13.59,37.47 13.33,37.72 13.33,42.55 14.01,43.22 14.79,43.22 15.1,43.52 R22.1
$1N396: length 5.5
  Top Layer w0.305: R22.2 15.1,64.91 14.73,65.28 10.7,65.28 DB1.3
$1N410: length 22
  Top Layer w0.305: U6.12 45.97,37.08 46.1,37.21 46.1,40.26 46.61,40.77 60.2,40.77 60.58,41.15 JP1.2
$1N453: length 23.4
  Top Layer w1.423: 7.37,28.09 11.93,28.09 arc(12.04,28.05) Q2.3 12.06,27.92 12.06,25.15 12.7,24.51 v1(14.35,24.51)
  Bottom Layer w1.423: RELAY1.2 13.72,13.59 14.35,14.22 v1(14.35,23.85) v1(14.35,24.51)
  vias: v1(13.72,24.26)
$1N454: length 10.3
  Top Layer w0.305: R14.1 22.86,34.04 22.61,33.78 22.61,27.69 22.22,27.31 21.03,27.31 R17.2
$1N534: length 9.4
  Top Layer w0.305: 24.81,25.01 28.15,25.01 R10.2 ; 24.81,25.01 Q1.1 ; 24.81,25.01 R6.1
$1N571: length 38.6
  Top Layer w0.61: Q1.3 C5.1
  Top Layer w1.143: C5.1 v1(26.29,17.92)
  Top Layer w1.27: D1.2 33.3,6.45 33.53,6.22 BUZ1.2
  Bottom Layer w1.143: v1(26.29,17.92) 26.29,6.99 arc(26.44,6.63) 26.8,6.48 33.15,6.48 arc(33.42,6.37) 33.53,6.1 BUZ1.2
$1N627: length 20.1
  Top Layer w0.305: LCD1.3 34.93,78.66 34.93,81.41 34.67,81.66 R18.1
$1N796: length 3.2
  Top Layer w0.61: LED1.1 75.89,29.96
$1N816: length 3.5
  Top Layer w0.61: LED3.1 75.89,39.36
$1N817: length 3.4
  Top Layer w0.61: LED2.1 75.89,34.66
$1N1047: length 8.6
  Top Layer w1.423: U2.2 60.07,10.29 60.4,10.62 R7.2
$1N2159: length 3.4
  Top Layer w0.914: R15.1 40.12,19.49 Q3.2
$1N2169: length 3.6
  Top Layer w0.914: Q3.1 39.86,17.59 R16.1
$1N3986: length 19.1
  Top Layer w0.914: R23.1 62.36,27.05 61.72,26.42 R24.1 61.65,24.13 60.32,24.13 60.07,23.88 60.07,22.86 59.69,22.48 C19.1 52.71,22.34 52.71,20.83 52.96,20.57 U4.5

## Copper pours and planes (outline as drawn; the poured copper is in the pictures)
GND on Top Layer: 13.33,30.1 21.84,30.1 21.84,28.19 13.33,28.19
GND on Top Layer: 88.9,31.88 92.74,31.88 92.74,26.29 88.9,26.29
GND on Top Layer: -0.38,85.22 105.41,85.22 105.41,-0.38 -0.38,-0.38
GND on Bottom Layer: -0.38,85.22 105.41,85.22 105.41,-0.38 -0.38,-0.38
VDD on Top Layer: 76.86,40.44 97.79,40.44 97.79,20.45 76.86,20.45
VDD on Top Layer: 53.09,43.83 59.31,43.83 59.31,41.4 53.09,41.4
DC_IN on Top Layer: 83.82,12.7 91.44,12.7 91.44,6.76 83.82,6.76
DC_OUT on Top Layer: 53.33,19.69 55.63,19.69 55.63,17.53 53.33,17.53
VREF on Top Layer: 66.01,11.05 75.31,11.05 75.31,7.79 66.01,7.79
$1N129 on Top Layer: 63.5,25.42 65.53,25.42 65.53,17.15 63.5,17.15
$1N454 on Top Layer: 13.1,27.94 21.87,27.94 21.87,26.43 13.1,26.43
$1N913 on Top Layer: 80.26,19.94 82.55,19.94 82.55,7.11 80.26,7.11
$1N913 on Top Layer: 80.26,18.75 96.9,18.75 96.9,17.23 80.26,17.23

Small or netless copper shapes (teardrops, artwork), in the pictures only: 159 on Top Layer, 3 on Bottom Layer
